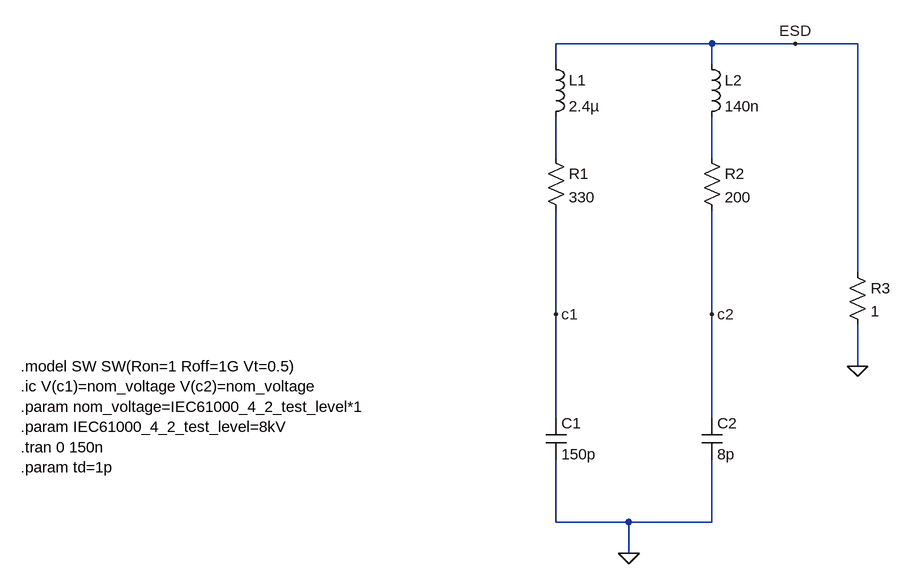
[diagram p0: schematic ESD2.asc]
ESD2.asc, the LTspice schematic file:
Version 4
SHEET 1 880 1028
WIRE 128 -48 -112 -48
WIRE 256 -48 128 -48
WIRE 352 -48 256 -48
WIRE -112 -16 -112 -48
WIRE 128 -16 128 -48
WIRE -112 128 -112 64
WIRE 128 128 128 64
WIRE 352 304 352 -48
WIRE -112 368 -112 208
WIRE 128 368 128 208
WIRE 352 448 352 384
WIRE -112 528 -112 368
WIRE 128 528 128 368
WIRE -112 688 -112 592
WIRE 0 688 -112 688
WIRE 128 688 128 592
WIRE 128 688 0 688
WIRE 0 736 0 688
FLAG 0 736 0
FLAG 256 -48 ESD
FLAG 352 448 0
FLAG -112 368 c1
FLAG 128 368 c2
SYMBOL ind -128 -32 R0
SYMATTR InstName L1
SYMATTR Value 2.4µ
SYMBOL ind 112 -32 R0
SYMATTR InstName L2
SYMATTR Value 140n
SYMBOL res -128 112 R0
SYMATTR InstName R1
SYMATTR Value 330
SYMBOL res 112 112 R0
SYMATTR InstName R2
SYMATTR Value 200
SYMBOL cap -128 528 R0
SYMATTR InstName C1
SYMATTR Value 150p
SYMBOL cap 112 528 R0
SYMATTR InstName C2
SYMATTR Value 8p
SYMBOL res 336 288 R0
SYMATTR InstName R3
SYMATTR Value 1
TEXT -936 448 Left 2 !.model SW SW(Ron=1 Roff=1G Vt=0.5)\n.ic V(c1)=nom_voltage V(c2)=nom_voltage\n.param nom_voltage=IEC61000_4_2_test_level*1\n.param IEC61000_4_2_test_level=8kV\n.tran 0 150n\n.param td=1p

The netlist it stands for:
* ESD2.asc
L1 ESD N001 2.4µ
L2 ESD N002 140n
R1 N001 c1 330
R2 N002 c2 200
C1 c1 0 150p
C2 c2 0 8p
R3 ESD 0 1
.model SW SW(Ron=1 Roff=1G Vt=0.5)
.ic V(c1)=nom_voltage V(c2)=nom_voltage
.param nom_voltage=IEC61000_4_2_test_level*1
.param IEC61000_4_2_test_level=8kV
.tran 0 150n
.param td=1p
.backanno
.end